# EAGLE design 20226 (EAGLE 7.6.0)
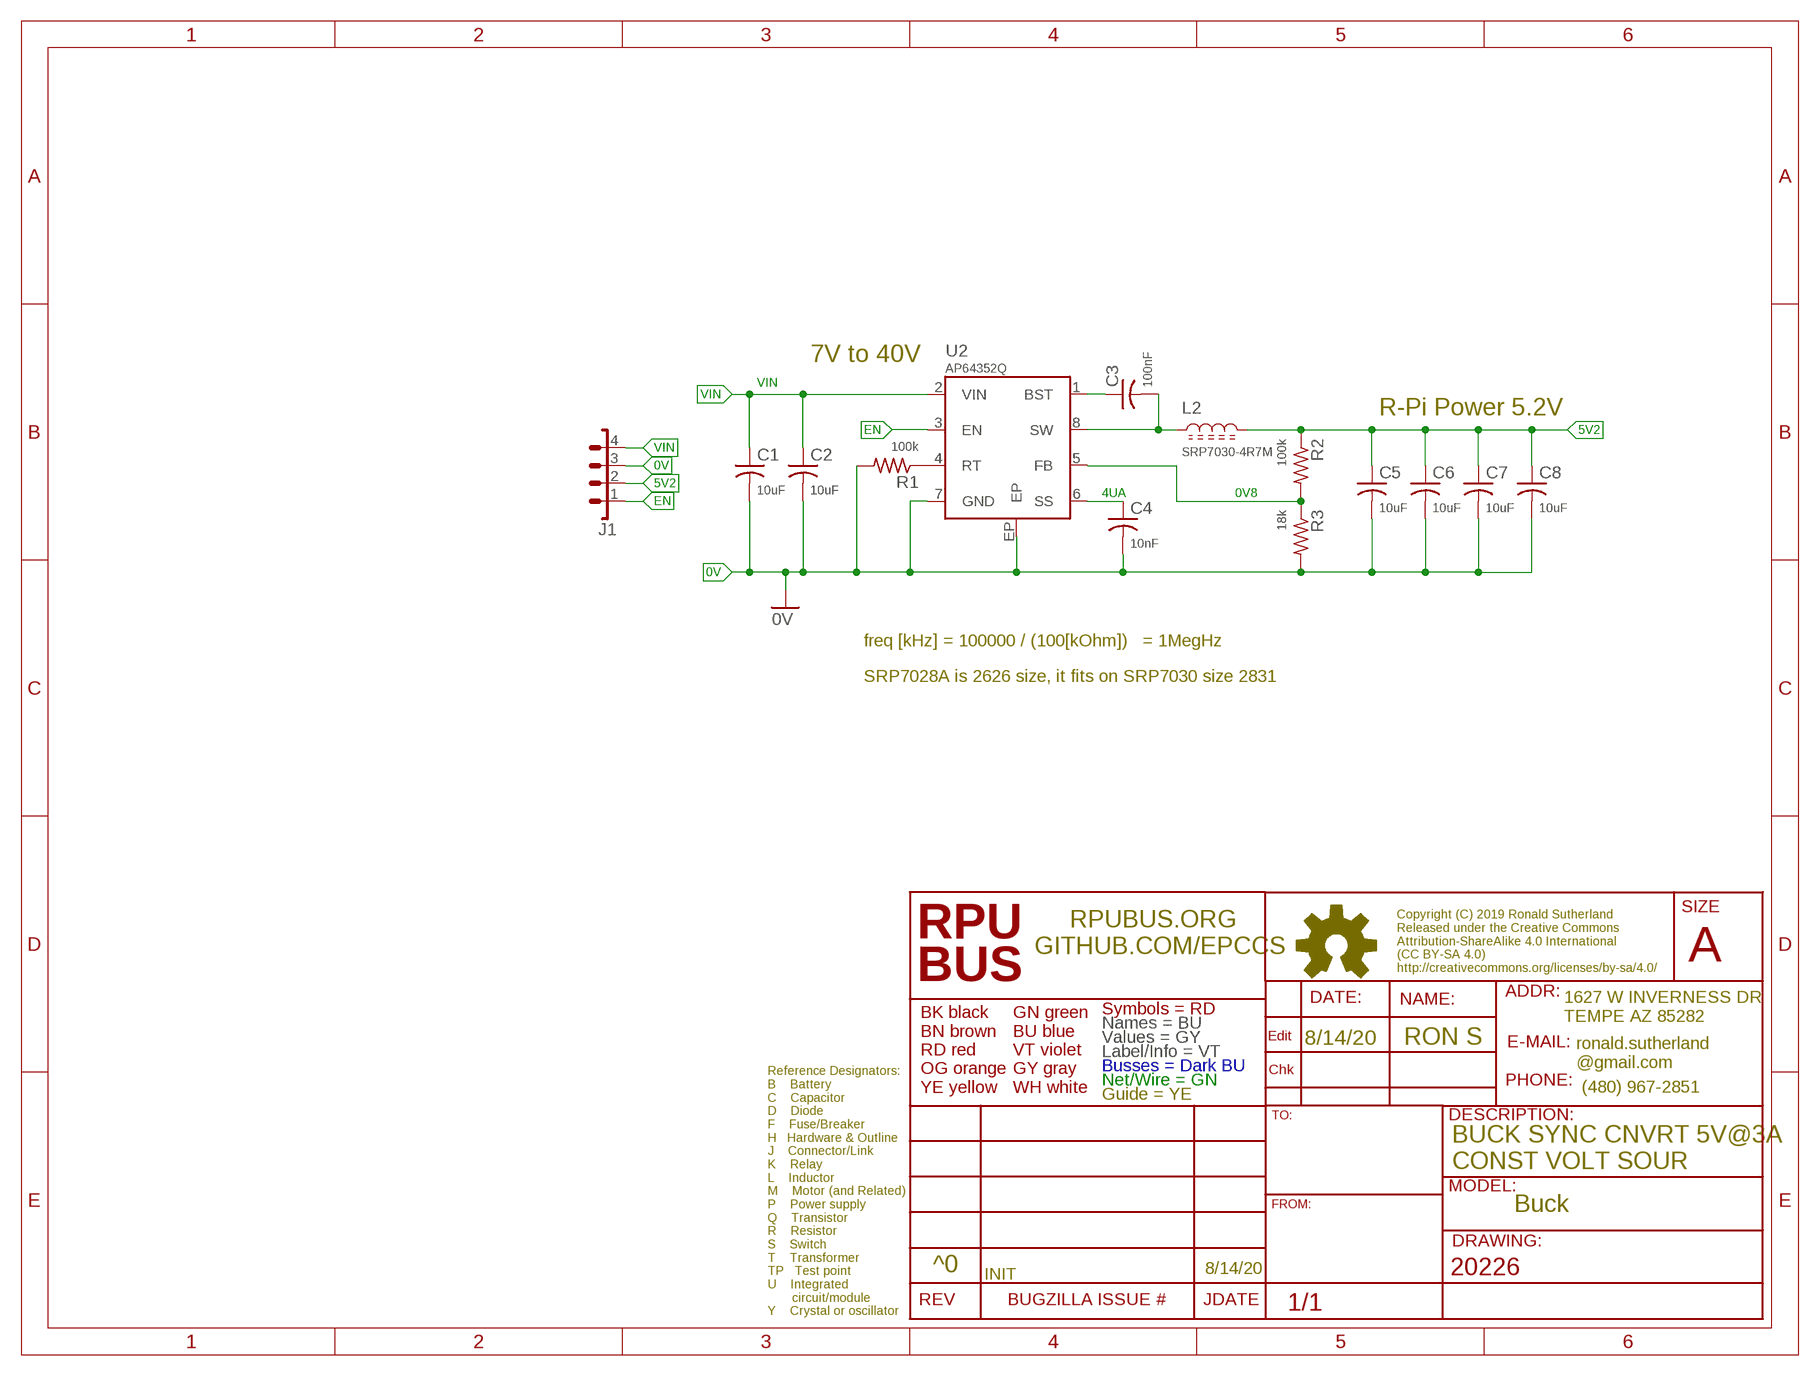
[diagram p0: schematic, sheet 1]

## Parts
C1  10uF  CC1206  [C1206(3216)]
C2  10uF  CC1206  [C1206(3216)]
C3  100nF  CC0603A  [C0603(1608)]
C4  10nF  CC0603A  [C0603(1608)]
C5  10uF  CC1206  [C1206(3216)]
C6  10uF  CC1206  [C1206(3216)]
C7  10uF  CC1206  [C1206(3216)]
C8  10uF  CC1206  [C1206(3216)]
J1  1X4  [1X4]
L2  SRP7030-4R7M  L2831  [L2831]
R1  100k  R0805  [C0805(2012)]
R2  100k  R0805  [C0805(2012)]
R3  18k  R0805  [C0805(2012)]
U2  AP64352Q  [SOIC8EP]

## Nets
0V: C1.2 C2.2 C4.2 C5.2 C6.2 C7.2 C8.2 J1.3 R1.2 R3.2 U2.7(GND) U2.EP
0V8: R2.2 R3.1 U2.5(FB)
4UA: C4.1 U2.6(SS)
5V2: C5.1 C6.1 C7.1 C8.1 J1.2 L2.2 R2.1
EN: J1.1 U2.3(EN)
N$2: R1.1 U2.4(RT)
N$3: C3.1 U2.1(BST)
N$4: C3.2 L2.1 U2.8(SW)
VIN: C1.1 C2.1 J1.4 U2.2(VIN)

## Notes on the sheet
- 7V to 40V
- R-Pi Power 5.2V
- freq [kHz] = 100000 / (100[kOhm])   = 1MegHz
- SRP7028A is 2626 size, it fits on SRP7030 size 2831
- 8/14/20 | RON S
- BUCK SYNC CNVRT 5V@3A 
  CONST VOLT SOUR
- Buck
- ^0 | 8/14/20
- INIT

## Library data of the parts
C1-C8 = C-C:C: CAPACITOR Symbol
J1 = J-HDR2.54mm:1X4: 4 POS HEADER PBC04SAAN [SULLINS,PBC04SAAN] HEADER MALE BRKWAY 4POS .1IN AA
L2 = L-PWR:L: Inductor
R1-R3 = R-C:R: Resiistor American-style symbol
U2 = U-Linear:AP64352Q: AP64352Q [DIODES@AP64352QSP-13] DCDC CONV BUCK POL SO-8EP

## Net classes
0 default: width 0.178 mm, drill 0.33 mm

## Board
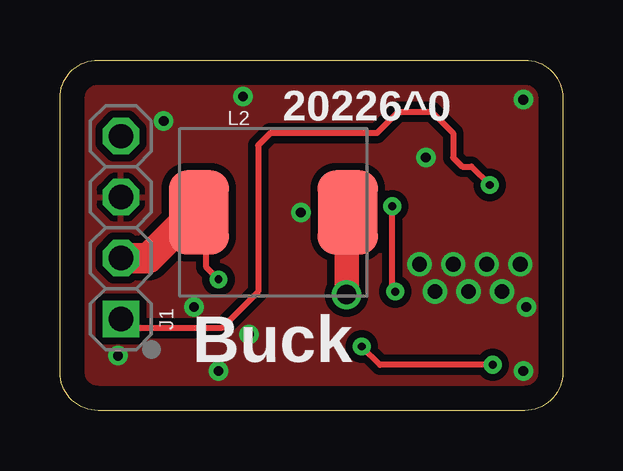
[diagram p1: board, top side]
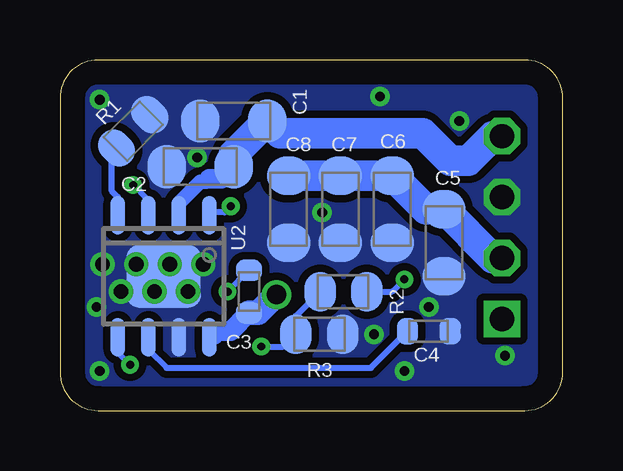
[diagram p2: board, bottom side, seen from below]

Size 20.95 x 14.61 mm. Coordinates in mm from the lower left corner, seen from the top.
Outline: 20.95,13.02 20.95,1.59 arc-90 19.37,0 1.59,0 arc-90 0,1.59 0,13.02 arc-90 1.59,14.61 19.37,14.61 arc-90 20.95,13.02
Copper layers (1*16): Top 0.034290625mm / dielectric 60mil / Bottom 0.034290625mm
Design rules "default *": minimum track width 10mil, minimum drill 13mil, track to track 8mil, track to pad 8mil, pad to pad 8mil, via to via 8mil, smd to smd 8mil, copper to edge 40mil, drill to drill 12mil, minimum pad ring 10mil, minimum via ring 8mil, stop-mask expansion 4mil, vias tented up to drill 17mil, thermal gap 10mil

### Footprints (pad centres in the part's own frame; a part is rotated, then mirrored left to right if it is on the bottom)
C1206(3216) = smd 1.6 x 1.8: 1 -1.4,0; 2 1.4,0
C0603(1608) = smd 0.898 x 1.1: 1 -0.889,0; 2 0.889,0
1X4 = drill 1.016 square: 1 0,0 | drill 1.016 octagon: 2 2.54,0; 3 5.08,0; 4 7.62,0
L2831 = smd 2.5 x 3.5: 1 3.1,0; 2 -3.1,0
C0805(2012) = smd 1.321 x 1.651: 1 -0.977,0; 2 0.977,0
SOIC8EP = smd 0.6 x 1.6: 1 -1.905,-2.54; 2 -0.635,-2.54; 3 0.635,-2.54; 4 1.905,-2.54; 5 1.905,2.54; 6 0.635,2.54; 7 -0.635,2.54; 8 -1.905,2.54 | smd 3.1 x 2.6: EP 0,0

### Placement (x,y rotation side)
C1  13.72,12.06 180 bottom
C2  15.11,10.16 180 bottom
C3  13.08,4.95 270 bottom
C4  5.59,3.3 0 bottom
C5  4.95,6.99 270 bottom
C6  7.11,8.38 270 bottom
C7  9.27,8.38 270 bottom
C8  11.43,8.38 270 bottom
J1  2.54,3.81 90 top
L2  8.89,8.26 0 top
R1  17.91,11.63 45 bottom
R2  9.14,4.95 180 bottom
R3  10.16,3.17 0 bottom
U2  16.64,5.59 180 bottom

### Tracks (layer width: path | path; a pad name or v marks a point on that pad's centre or on a via)
0V  (via drill 0.41, 0.61)
  other vias: 7.62,13.08 10.03,8.26 2.41,2.29 19.3,12.95 7.87,3.17 6.6,1.65 19.3,1.65 14.99,6.1 17.78,6.1 19.18,6.1 16.38,6.1 15.62,4.95 17.02,4.95 18.41,4.95 19.43,4.32 15.24,10.54 4.32,12.06 5.59,4.32
  pour Top (isolate 0.305): 20.95,0 0,0 0,14.61 20.95,14.61
  pour Bottom (isolate 0.305, no thermals): 0,14.61 20.95,14.61 20.95,0 0,0
0V8  (via drill 0.33)
  Top 0.254: v18.03,1.91 13.34,1.91 v12.57,2.67
  Bottom 0.254: U2.5 18.54,2.41 v18.03,1.91 | v12.57,2.67 11.64,2.67 R3.1 11.14,3.94 R2.2
4UA
  Bottom 0.254: U2.6 17.27,2.54 16.51,1.78 8,1.78 C4.1
5V2  (via drill 0.33)
  Top 0.254: v6.6,5.46 6.1,5.97 6.1,7.95 L2.2
  Top 1.27: L2.2 5.59,8.26 3.68,6.35 J1.2
  Bottom 0.254: R2.1 7.11,4.95 v6.6,5.46
  Bottom 1.27: J1.2 2.92,6.35 C5.1 5.71,8.38 C6.1 C7.1 C8.1
EN  (via drill 0.33)
  Top 0.254: J1.1 2.92,3.43 6.73,3.43 8.26,4.95 8.26,11.05 8.76,11.56 13.21,11.56 14.1,12.45 15.49,12.45 16.38,11.56 16.38,10.54 16.76,10.16 17.14,10.16 v17.91,9.4
  Bottom 0.254: U2.3 17.27,8.76 v17.91,9.4
N$2
  Bottom 0.254: U2.4 18.54,8.89 18.8,9.14 18.8,10.74 R1.1
N$3  (via drill 0.33)
  Top 0.254: v13.97,4.95 13.84,5.08 v13.84,8.51
  Bottom 0.254: C3.1 v13.97,4.95 | v13.84,8.51 14.1,8.26 14.61,8.26 U2.1
N$4  (via drill 0.81)
  Top 1.016: v11.94,4.83 11.94,8.2 L2.1
  Bottom 0.61: U2.8 14.48,3.05 14.22,3.3
  Bottom 0.813: 14.22,3.3 13.84,3.3 C3.2
  Bottom 1.016: C3.2 12.7,4.06 v11.94,4.83
VIN
  Bottom 0.61: U2.2 16,8.64 15.11,9.53 14.86,9.53 14.73,9.65
  Bottom 0.813: 14.73,9.65 14.22,9.65 C2.1
  Bottom 1.27: J1.4 2.92,11.43 3.94,10.41 4.7,10.41 5.84,11.56 11.81,11.56 C1.1 13.71,10.67 C2.1

### Text on the board
tPlace: 20226^0 | Buck